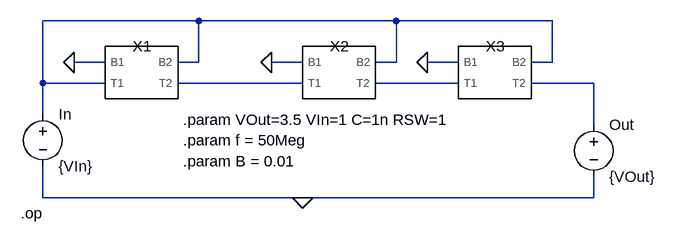
[diagram p0: schematic Dickson_Model_N=3.asc]
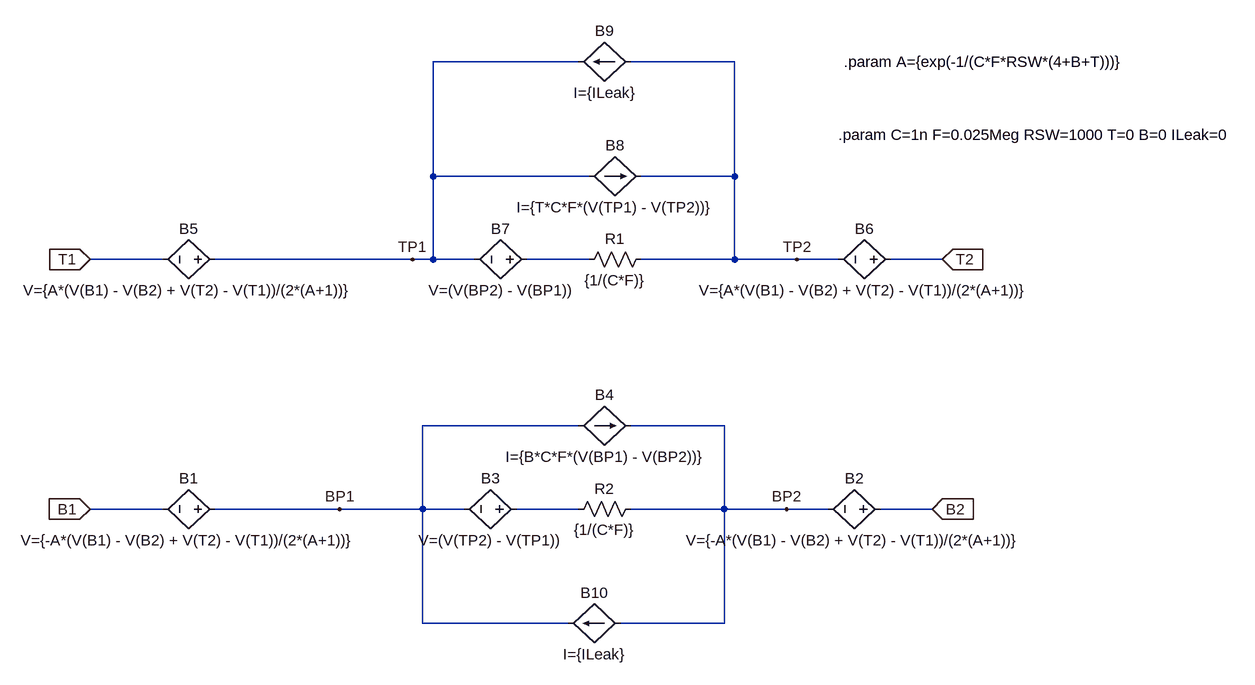
[diagram p1: sub-circuit leakagemodel.asc]
Dickson_Model_N=3.asc, the LTspice schematic file:
Version 4
SHEET 1 1428 680
WIRE 192 80 -48 80
WIRE 496 80 192 80
WIRE 736 80 496 80
WIRE 48 144 0 144
WIRE 192 144 192 80
WIRE 192 144 160 144
WIRE 352 144 304 144
WIRE 496 144 496 80
WIRE 496 144 464 144
WIRE 592 144 544 144
WIRE 736 144 736 80
WIRE 736 144 704 144
WIRE -48 176 -48 80
WIRE 48 176 -48 176
WIRE 352 176 160 176
WIRE 592 176 464 176
WIRE 800 176 704 176
WIRE -48 224 -48 176
WIRE 800 240 800 176
WIRE -48 352 -48 304
WIRE 352 352 -48 352
WIRE 800 352 800 320
WIRE 800 352 352 352
FLAG 0 144 0
FLAG 304 144 0
FLAG 544 144 0
FLAG 352 352 0
SYMBOL leakagemodel 640 160 R0
SYMATTR InstName X3
SYMATTR SpiceLine RSW={RSW*0.5}, f={f}, C={2*C},B={B},T={B}
SYMBOL voltage -48 208 R0
SYMATTR InstName In
SYMATTR Value {VIn}
SYMBOL voltage 800 224 R0
SYMATTR InstName Out
SYMATTR Value {VOut}
SYMBOL leakagemodel 96 160 R0
SYMATTR InstName X1
SYMATTR SpiceLine RSW={RSW*0.5}, f={f}, C={2*C},B={B},T={B}
SYMBOL leakagemodel 400 160 R0
SYMATTR InstName X2
SYMATTR SpiceLine RSW={RSW*0.5}, f={f}, C={2*C},B={B},T={B}
TEXT 168 232 Left 2 !.param VOut=3.5 VIn=1 C=1n RSW=1
TEXT 168 264 Left 2 !.param f = 50Meg
TEXT 168 296 Left 2 !.param B = 0.01
TEXT -82 376 Left 2 !.op

leakagemodel.asc, the sub-circuit schematic file:
Version 4
SHEET 1 1496 680
WIRE 336 -512 112 -512
WIRE 576 -512 416 -512
WIRE 112 -336 112 -512
WIRE 352 -336 112 -336
WIRE 576 -336 576 -512
WIRE 576 -336 432 -336
WIRE -304 -208 -416 -208
WIRE 80 -208 -224 -208
WIRE 112 -208 112 -336
WIRE 112 -208 80 -208
WIRE 176 -208 112 -208
WIRE 352 -208 256 -208
WIRE 576 -208 576 -336
WIRE 576 -208 432 -208
WIRE 672 -208 576 -208
WIRE 736 -208 672 -208
WIRE 896 -208 816 -208
WIRE 336 48 96 48
WIRE 560 48 416 48
WIRE -304 176 -416 176
WIRE -32 176 -224 176
WIRE 96 176 96 48
WIRE 96 176 -32 176
WIRE 160 176 96 176
WIRE 336 176 240 176
WIRE 560 176 560 48
WIRE 560 176 416 176
WIRE 656 176 560 176
WIRE 720 176 656 176
WIRE 880 176 800 176
WIRE 96 352 96 176
WIRE 320 352 96 352
WIRE 560 352 560 176
WIRE 560 352 400 352
FLAG -416 176 B1
IOPIN -416 176 In
FLAG 880 176 B2
IOPIN 880 176 In
FLAG 656 176 BP2
FLAG -32 176 BP1
FLAG -416 -208 T1
IOPIN -416 -208 In
FLAG 896 -208 T2
IOPIN 896 -208 In
FLAG 672 -208 TP2
FLAG 80 -208 TP1
SYMBOL res 432 160 R90
WINDOW 0 0 56 VBottom 2
WINDOW 3 32 56 VTop 2
SYMATTR InstName R2
SYMATTR Value {1/(C*F)}
SYMBOL bv 256 176 R90
WINDOW 0 -32 56 VBottom 2
WINDOW 3 32 56 VTop 2
SYMATTR InstName B3
SYMATTR Value V=(V(TP2) - V(TP1))
SYMBOL bi 336 48 R270
WINDOW 0 32 40 VTop 2
WINDOW 3 -32 40 VBottom 2
SYMATTR InstName B4
SYMATTR Value I={B*C*F*(V(BP1) - V(BP2))}
SYMBOL res 448 -224 R90
WINDOW 0 0 56 VBottom 2
WINDOW 3 32 56 VTop 2
SYMATTR InstName R1
SYMATTR Value {1/(C*F)}
SYMBOL bv -208 -208 R90
WINDOW 0 -32 56 VBottom 2
WINDOW 3 32 56 VTop 2
SYMATTR InstName B5
SYMATTR Value V={A*(V(B1) - V(B2) + V(T2) - V(T1))/(2*(A+1))}
SYMBOL bv 272 -208 R90
WINDOW 0 -32 56 VBottom 2
WINDOW 3 32 56 VTop 2
SYMATTR InstName B7
SYMATTR Value V=(V(BP2) - V(BP1))
SYMBOL bi 352 -336 R270
WINDOW 0 32 40 VTop 2
WINDOW 3 -32 40 VBottom 2
SYMATTR InstName B8
SYMATTR Value I={T*C*F*(V(TP1) - V(TP2))}
SYMBOL bv 832 -208 R90
WINDOW 0 -32 56 VBottom 2
WINDOW 3 32 56 VTop 2
SYMATTR InstName B6
SYMATTR Value V={A*(V(B1) - V(B2) + V(T2) - V(T1))/(2*(A+1))}
SYMBOL bi 416 -512 M270
WINDOW 0 32 40 VTop 2
WINDOW 3 -32 40 VBottom 2
SYMATTR InstName B9
SYMATTR Value I={ILeak}
SYMBOL bi 400 352 M270
WINDOW 0 32 40 VTop 2
WINDOW 3 -32 40 VBottom 2
SYMATTR InstName B10
SYMATTR Value I={ILeak}
SYMBOL bv -208 176 R90
WINDOW 0 -32 56 VBottom 2
WINDOW 3 32 56 VTop 2
SYMATTR InstName B1
SYMATTR Value V={-A*(V(B1) - V(B2) + V(T2) - V(T1))/(2*(A+1))}
SYMBOL bv 816 176 R90
WINDOW 0 -32 56 VBottom 2
WINDOW 3 32 56 VTop 2
SYMATTR InstName B2
SYMATTR Value V={-A*(V(B1) - V(B2) + V(T2) - V(T1))/(2*(A+1))}
TEXT 736 -400 Left 2 !.param C=1n F=0.025Meg RSW=1000 T=0 B=0 ILeak=0
TEXT 744 -512 Left 2 !.param A={exp(-1/(C*F*RSW*(4+B+T)))}

The netlist it stands for:
* Dickson_Model_N=3.asc
XX3 0 N001 N003 N004 leakagemodel params: RSW={RSW*0.5}, f={f}, C={2*C},B={B},T={B}
V§In N001 0 {VIn}
V§Out N004 0 {VOut}
XX1 0 N001 N001 N002 leakagemodel params: RSW={RSW*0.5}, f={f}, C={2*C},B={B},T={B}
XX2 0 N001 N002 N003 leakagemodel params: RSW={RSW*0.5}, f={f}, C={2*C},B={B},T={B}

* block symbol definitions
.subckt leakagemodel B1 B2 T1 T2
R2 BP2 N002 {1/(C*F)}
B3 N002 BP1 V=(V(TP2) - V(TP1))
B4 BP1 BP2 I={B*C*F*(V(BP1) - V(BP2))}
R1 TP2 N001 {1/(C*F)}
B5 TP1 T1 V={A*(V(B1) - V(B2) + V(T2) - V(T1))/(2*(A+1))}
B7 N001 TP1 V=(V(BP2) - V(BP1))
B8 TP1 TP2 I={T*C*F*(V(TP1) - V(TP2))}
B6 T2 TP2 V={A*(V(B1) - V(B2) + V(T2) - V(T1))/(2*(A+1))}
B9 TP2 TP1 I={ILeak}
B10 BP2 BP1 I={ILeak}
B1 BP1 B1 V={-A*(V(B1) - V(B2) + V(T2) - V(T1))/(2*(A+1))}
B2 B2 BP2 V={-A*(V(B1) - V(B2) + V(T2) - V(T1))/(2*(A+1))}
.param C=1n F=0.025Meg RSW=1000 T=0 B=0 ILeak=0
.param A={exp(-1/(C*F*RSW*(4+B+T)))}
.ends leakagemodel

.param VOut=3.5 VIn=1 C=1n RSW=1
.param f = 50Meg
.param B = 0.01
.op
.backanno
.end